# EAGLE design transmitter_150Mhz (EAGLE 9.5.1)
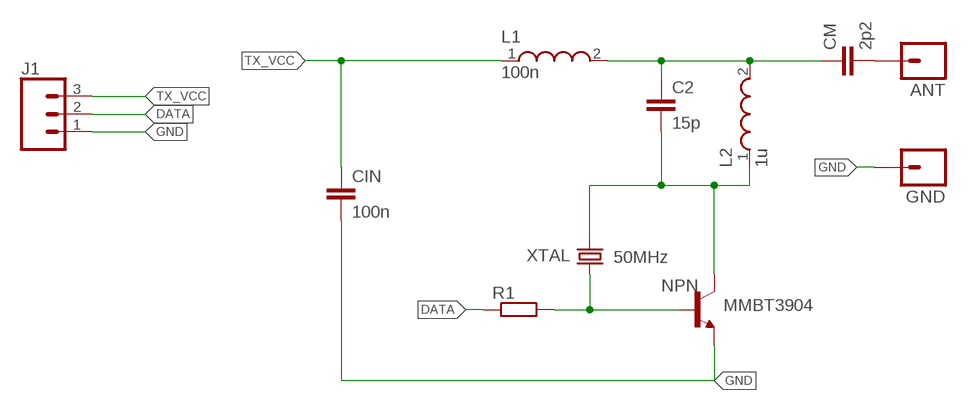
[diagram p0: schematic, sheet 1]

## Parts
ANT  M01OFFSET  [1X01_OFFSET]
C2  15p  C-EUC0603  [C0603]
CIN  100n  C-EUC0603  [C0603]
CM  2p2  C-EUC0603  [C0603]
GND  M01OFFSET  [1X01_OFFSET]
J1  CONN_03  [1X03]
L1  100n  WE-PMI_0805  [WE-PMI_0805]
L2  1u  WE-PMI_0806  [WE-PMI_0806]
NPN  MMBT3904  MMBT3904LT1-NPN-SOT23-BEC  [SOT23-BEC]
R1  R-EU_R0603  [R0603]
XTAL  50MHz  CRYSTALSM49  [SM49]

## Nets
ANT: C2.1 CM.1 L1.2 L2.2
DATA: J1.2 R1.1
GND: CIN.2 GND.1 J1.1 NPN.E
N$1: ANT.1 CM.2
N$3: NPN.B R1.2 XTAL.1
N$4: C2.2 L2.1 NPN.C XTAL.2
TX_VCC: CIN.1 J1.3 L1.1

## Library data of the parts
ANT GND = SparkFun-Connectors:M01: Header 1 Standard 1-pin 0.1" header. Use with straight break away headers (SKU : PRT-00116), right angle break away headers (PRT-00553), swiss pins (PRT-00743), machine pins (PRT-00117), and female headers (PRT-00115).
C2 CIN CM = resistor:C-EU: CAPACITOR, European symbol
J1 = SparkFun-Connectors:CONN_03: Multi connection point. Often used as Generic Header-pin footprint for 0.1 inch spaced/style header connections On any of the 0.1 inch spaced packages, you can populate with these: Break Away Headers - Straight <https://www.sparkfun.com/products/116> (PRT-00116) Break Away Male Headers - Right Angle <https://www.sparkfun.com/products/553> (PRT-00553) Female Headers <https://www.sparkfun.com/products/115> (PRT-00115) Break Away Headers - Machine Pin <https://www.sparkfun.com/products/117> (PRT-00117) Break Away Female Headers - Swiss Machine Pin <https://www.sparkfun.com/products/743> (PRT-00743) Stackable Header - 3 Pin (Female, 0.1") <https://www.sparkfun.com/products/13875> (PRT-13875) For SCREWTERMINALS and SPRING TERMINALS visit here: Screw Terimnals on SparkFun.com <https://www.sparkfun.com/search/results?term=Screw+Terminals> (5mm/3.5mm/2.54mm spacing) This device is also useful as a general connection point to wire up your design to another part of your project. Our various solder wires solder well into these plated through hole pads. Hook-Up Wire - Assortment (Stranded, 22 AWG) <https://www.sparkfun.com/products/11375> (PRT-11375) Hook-Up Wire - Assortment (Solid Core, 22 AWG) <https://www.sparkfun.com/products/11367> (PRT-11367) View the entire wire category on our website here <https://www.sparkfun.com/categories/141> Special notes: Molex polarized connector foot print use with SKU : PRT-08232 with associated crimp pins and housings.
L1 L2 = Wurth_Elektronik_Passive_rev15b:WE-PMI: Power Multilayer Inductor Characteristics Compact multilayer type Suitable for applications with high currents up to 2.7 A Smallest RDC-Values starting at 40 mΩ Magnetically shielded construction: No crosstalk Operating temperature: –40 °C to +125 °C Available in four sizes and three different types (Low Profile, Low RDC & High Saturation Current) Recommended soldering profile: Reflow Applications DC/DC converters especially at high switching frequencies > 1 MHz Electronic devices with very low profile Portable devices like Smart Phones, Tablets, Notebooks and Digital Cameras <http://katalog.we-online.de/media/images/eisos/IndPMI_pf2.jpgg> Details see: http://katalog.we-online.de/en/pbs/WE-PMI? Updated by Dan Xu 2014-07-08 2014 (C) Wurth Elektronik
NPN = transistor:*-NPN-: NPN Transistror BF959 corrected 2008.03.06
R1 = resistor:R-EU_: RESISTOR, European symbol
XTAL = crystal:CRYSTAL: CRYSTAL; OC_FARNELL: unknown; OC_NEWARK: unknown

## Board
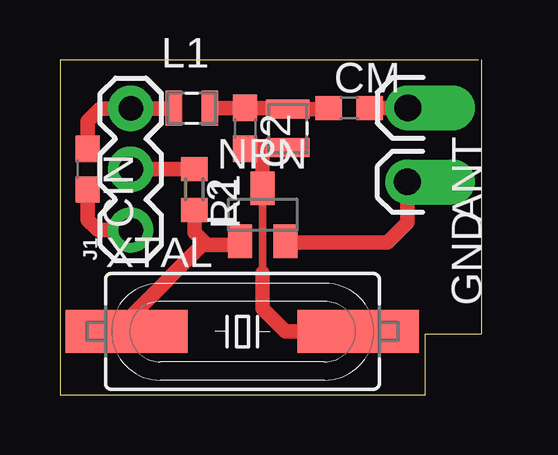
[diagram p1: board, top side]
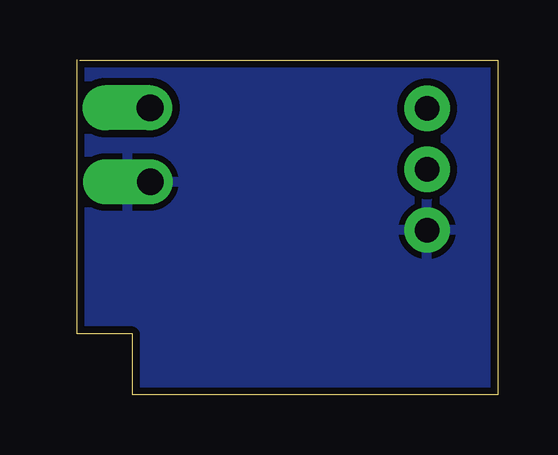
[diagram p2: board, bottom side, seen from below]

Size 17.57 x 13.97 mm. Coordinates in mm from the lower left corner, seen from the top.
Outline: 17.45,13.96 0,13.96 0,0 15.24,0 15.24,2.54 17.57,2.54 17.57,13.97
Copper layers (1*16): Top 0.035mm / dielectric 1.5mm / Bottom 0.035mm
Design rules "default *": minimum track width 10mil, minimum drill 24mil, track to track 8mil, track to pad 8mil, pad to pad 8mil, via to via 8mil, smd to smd 8mil, copper to edge 8mil, drill to drill 8mil, minimum pad ring 10mil, minimum via ring 8mil, stop-mask expansion 4mil, vias tented up to drill 0mil, thermal gap 10mil

### Footprints (pad centres in the part's own frame; a part is rotated, then mirrored left to right if it is on the bottom)
1X01_OFFSET = drill 1.118 pad 1.88 offset: 1 0,0
C0603 = smd 1.1 x 1: 1 -0.85,0; 2 0.85,0
1X03 = drill 1.016 pad 1.88: 1 0,0; 2 2.54,0; 3 5.08,0
WE-PMI_0805 = smd 0.7 x 1.45: 1 -0.75,0; 2 0.75,0
WE-PMI_0806 = smd 0.8 x 1.8: 1 -0.8,0; 2 0.8,0
SOT23-BEC = smd 1 x 1.4: B -0.95,-1.1; C 0,1.1; E 0.95,-1.1
R0603 = smd 1 x 1.1: 1 -0.85,0; 2 0.85,0
SM49 = smd 5.08 x 1.778: 1 -4.826,0; 2 4.826,0

### Placement (x,y rotation side)
ANT  14.5,11.97 270 top
C2  7.71,11.12 270 top
CIN  1.16,9.41 270 top
CM  12.07,11.96 0 top
GND  14.49,8.89 270 top
J1  2.95,6.87 90 top
L1  5.5,11.96 0 top
L2  9.5,11.11 90 top
NPN  8.46,7.51 0 top
R1  5.61,8.57 270 top
XTAL  7.61,2.65 0 top

### Tracks (layer width: path | path; a pad name or v marks a point on that pad's centre or on a via)
ANT
  Top 0.61: L1.2 7.71,11.96 C2.1 9.45,11.97 L2.2 11.17,11.91 CM.1
DATA
  Top 0.61: J1.2 R1.1
GND
  Top 0.61: CIN.2 1.16,7.3 1.59,6.88 J1.1 | GND.1 14.49,7.19 13.65,6.35 9.58,6.35 NPN.E
  pour Bottom (isolate 0.305): -0.42,14.39 18.21,14.39 18.1,-0.52 -0.53,-0.75
N$1
  Top 0.61: CM.2 14.49,11.96 ANT.1
N$3
  Top 0.61: 6.14,6.24 7.44,6.24 NPN.B | R1.2 5.61,6.77 6.14,6.24 | 6.14,6.24 5.93,6.24 3.07,3.39 3.07,2.93 XTAL.1
N$4
  Top 0.305: NPN.C 8.46,5.09
  Top 0.61: C2.2 8.36,10.27 | 8.36,10.27 9.46,10.27 L2.1 | NPN.C 8.46,10.17 8.36,10.27 | 8.46,5.09 8.46,3.61 9.42,2.65 XTAL.2
TX_VCC
  Top 0.61: CIN.1 1.16,11.43 1.69,11.95 J1.3 L1.1